# EAGLE design Linkable_LED_Matrix (EAGLE 7.1.0)
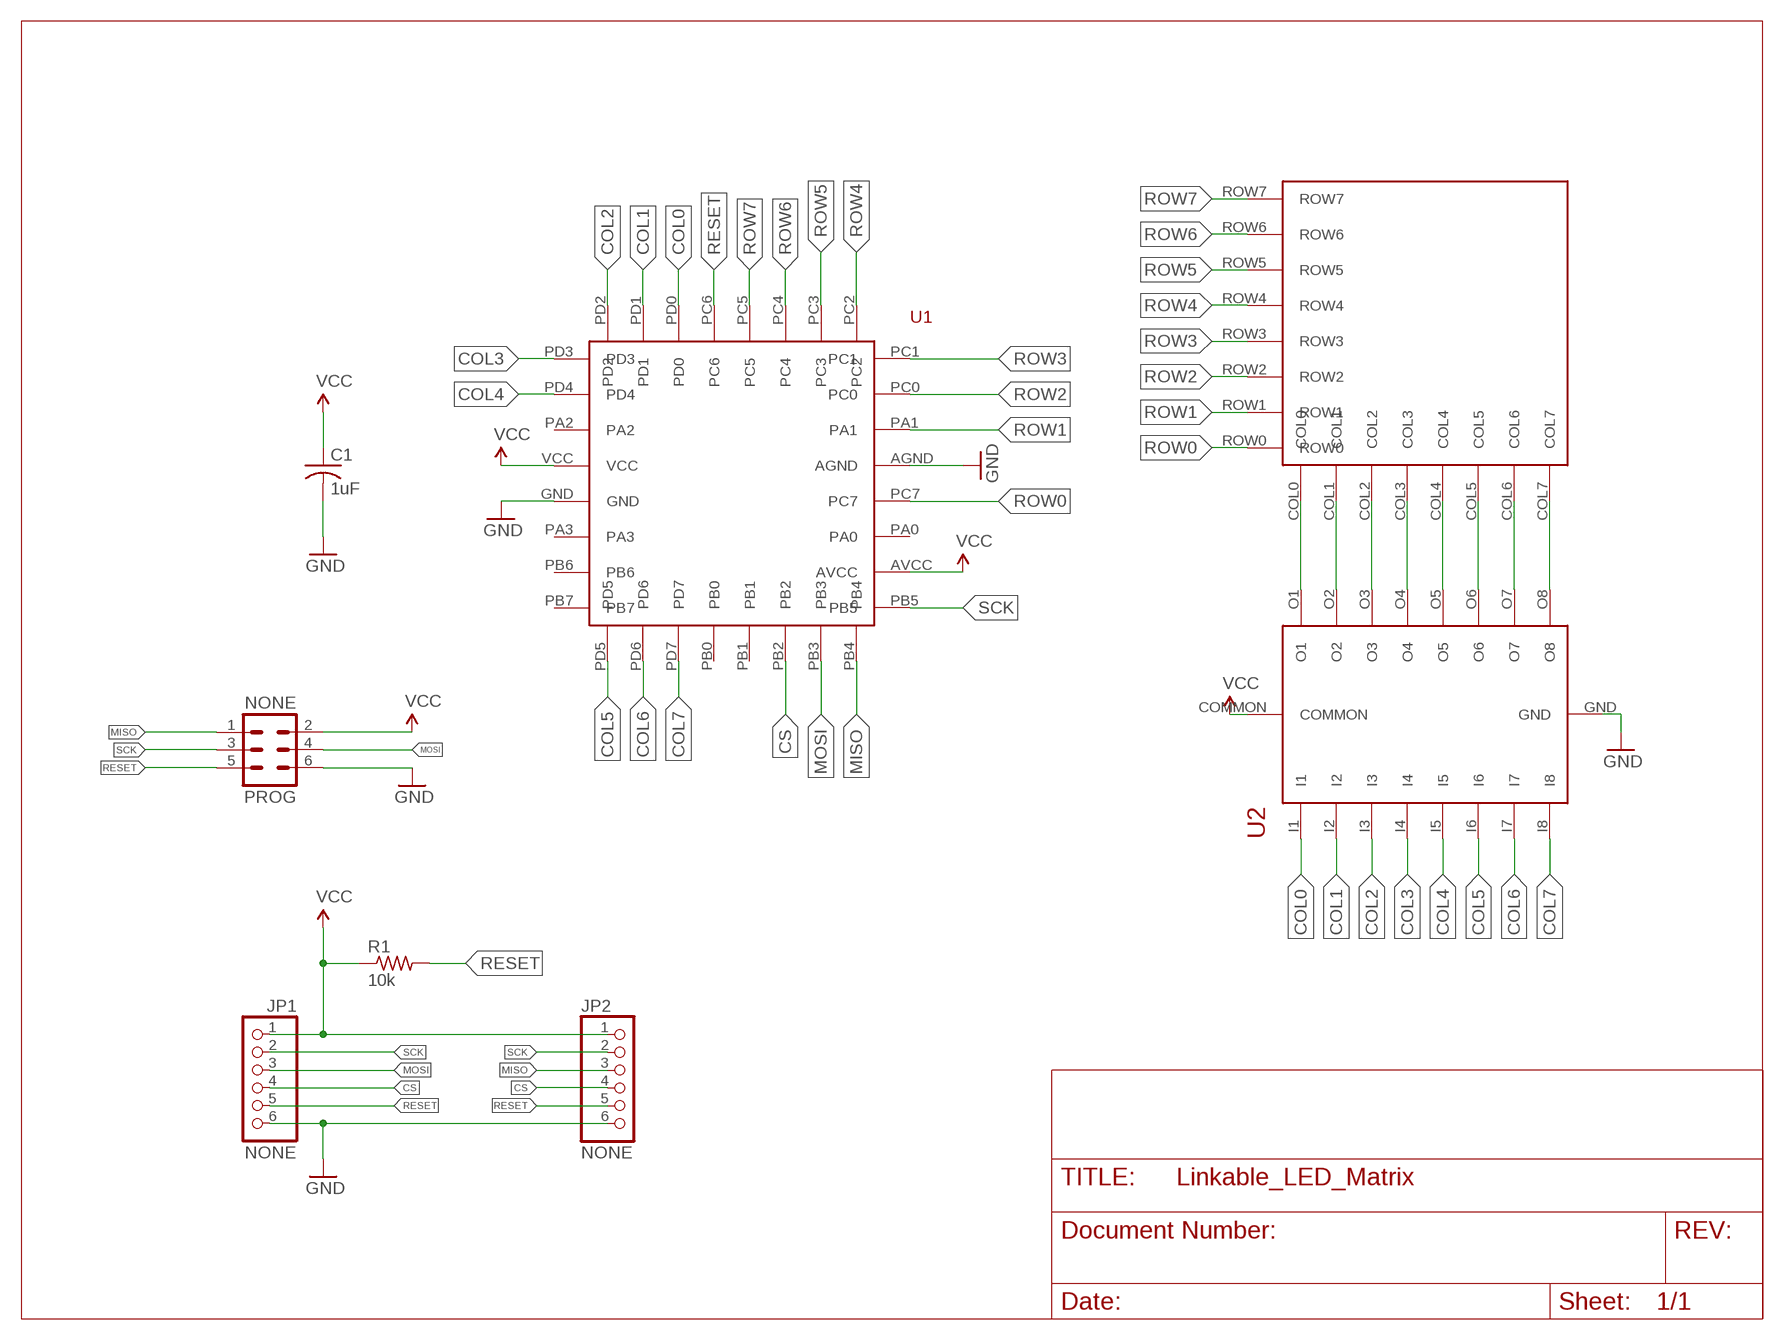
[diagram p0: schematic, sheet 1]

## Parts
C1  1uF  C-USC0603  [C0603]
JP1  NONE  PINHD-1X6  [1X06]
JP2  NONE  PINHD-1X6  [1X06]
LEDMATRIX  8X8_LED_MATRIX  [8X8_LED_MATRIX]
PROG  NONE  MA03-2  [MA03-2]
R1  10k  R-US_R0603  [R0603]
U1  ATTINY48  [ATTINY48]
U2  ULN2803AFWG  [ULN2803AFWG]

## Nets
COL0: U1.PD0 U2.I1
COL1: U1.PD1 U2.I2
COL2: U1.PD2 U2.I3
COL3: U1.PD3 U2.I4
COL4: U1.PD4 U2.I5
COL5: U1.PD5 U2.I6
COL6: U1.PD6 U2.I7
COL7: U1.PD7 U2.I8
CS: JP1.4 JP2.4 U1.PB2
GND: C1.2 JP1.6 JP2.6 PROG.6 U1.AGND U1.GND U2.GND
MISO: JP2.3 PROG.1 U1.PB4
MOSI: JP1.3 PROG.4 U1.PB3
N$1: LEDMATRIX.COL0 U2.O1
N$2: LEDMATRIX.COL1 U2.O2
N$3: LEDMATRIX.COL2 U2.O3
N$4: LEDMATRIX.COL3 U2.O4
N$5: LEDMATRIX.COL4 U2.O5
N$6: LEDMATRIX.COL5 U2.O6
N$7: LEDMATRIX.COL6 U2.O7
N$8: LEDMATRIX.COL7 U2.O8
RESET: JP1.5 JP2.5 PROG.5 R1.2 U1.PC6
ROW0: LEDMATRIX.ROW0 U1.PC7
ROW1: LEDMATRIX.ROW1 U1.PA1
ROW2: LEDMATRIX.ROW2 U1.PC0
ROW3: LEDMATRIX.ROW3 U1.PC1
ROW4: LEDMATRIX.ROW4 U1.PC2
ROW5: LEDMATRIX.ROW5 U1.PC3
ROW6: LEDMATRIX.ROW6 U1.PC4
ROW7: LEDMATRIX.ROW7 U1.PC5
SCK: JP1.2 JP2.2 PROG.3 U1.PB5
VCC: C1.1 JP1.1 JP2.1 PROG.2 R1.1 U1.AVCC U1.VCC U2.COMMON
Unconnected: U1.PA0 U1.PA2 U1.PA3 U1.PB0 U1.PB1 U1.PB6 U1.PB7

## Library data of the parts
C1 = resistor:C-US: CAPACITOR, American symbol
JP1 JP2 = raspberrystem:PINHD-1X6: PIN HEADER
LEDMATRIX = raspberrystem:8X8_LED_MATRIX
PROG = raspberrystem:MA03-2: PIN HEADER; OC_FARNELL: unknown; OC_NEWARK: unknown
R1 = resistor:R-US_: RESISTOR, American symbol
U1 = raspberrystem:ATTINY48
U2 = raspberrystem:ULN2803AFWG

## Net classes
1 power: width 0.305 mm

## Board
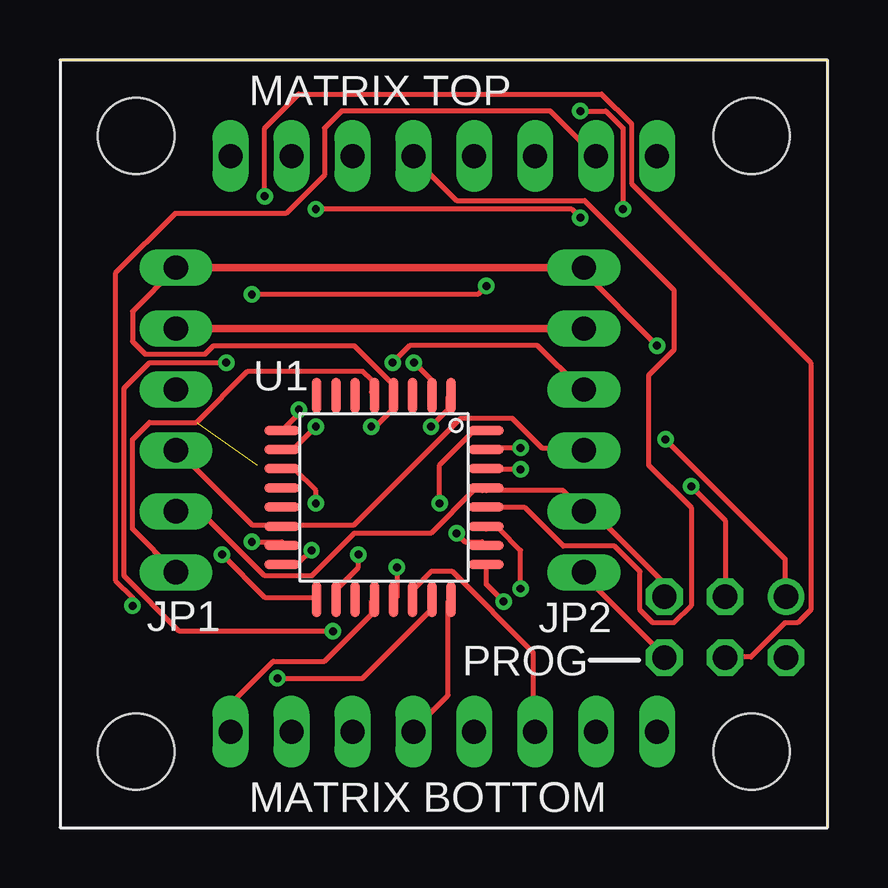
[diagram p1: board, top side]
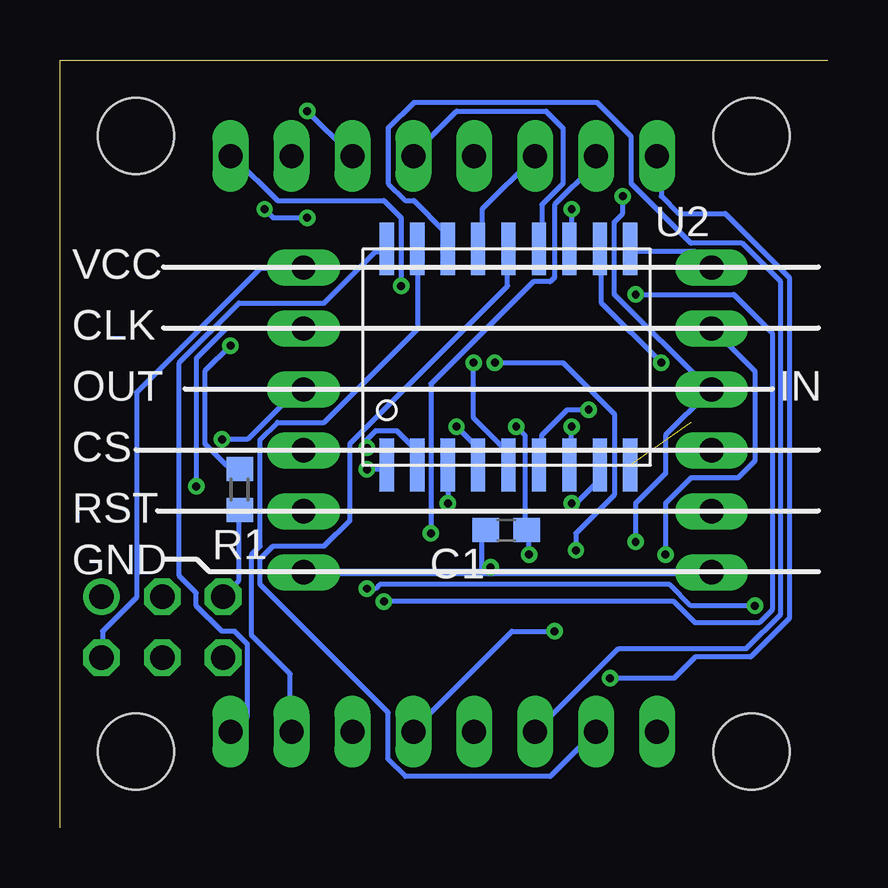
[diagram p2: board, bottom side, seen from below]

Size 32 x 32 mm. Coordinates in mm from the lower left corner, seen from the top.
Outline: 32,0 32,32 0,32
Copper layers (1*16): Top 0.0356mm / dielectric 1.5011mm / Bottom 0.0356mm
Design rules "LaenPCBOrder *": minimum track width 8mil, minimum drill 13mil, track to track 6mil, track to pad 6mil, pad to pad 6mil, via to via 6mil, smd to smd 6mil, copper to edge 15mil, drill to drill 6mil, minimum pad ring 7mil, minimum via ring 7mil, stop-mask expansion 3mil, vias tented up to drill 0mil, thermal gap 10mil
Holes 3.17 mm at 3.17,3.17 3.17,28.83 28.83,28.83 28.83,3.17
tRestrict: area 0,0 to 6.2,6.2; area 0,25.8 to 6.2,32; area 25.8,25.8 to 32,32; area 25.8,0 to 32,6.2
bRestrict: area 0,0 to 6.2,6.2; area 25.8,25.8 to 32,32; area 0,25.8 to 6.2,32; area 25.8,0 to 32,6.2
vRestrict: area 0,0 to 6.2,6.2; area 0,25.8 to 6.2,32; area 25.8,25.8 to 32,32; area 25.8,0 to 32,6.2; area 28.2,10.2 to 31.9,24.3; area 0,17.4 to 2.4,19.4

### Footprints (pad centres in the part's own frame; a part is rotated, then mirrored left to right if it is on the bottom)
C0603 = smd 1.1 x 1: 1 -0.85,0; 2 0.85,0
1X06 = drill 1.016 long: 1 -6.35,0; 2 -3.81,0; 3 -1.27,0; 4 1.27,0; 5 3.81,0; 6 6.35,0
8X8_LED_MATRIX = drill 1 long: COL0 8.89,-12; COL1 6.35,-12; COL2 -3.81,-12; COL3 -3.81,12; COL4 -6.35,-12; COL5 1.27,12; COL6 3.81,12; COL7 1.27,-12; ROW0 -8.89,-12; ROW1 3.81,-12; ROW2 -8.89,12; ROW3 -1.27,-12; ROW4 8.89,12; ROW5 -6.35,12; ROW6 6.35,12; ROW7 -1.27,12
MA03-2 = drill 1.016: 1 -2.54,-1.27 | drill 1.016 octagon: 2 -2.54,1.27; 3 0,-1.27; 4 0,1.27; 5 2.54,-1.27; 6 2.54,1.27
R0603 = smd 1 x 1.1: 1 -0.85,0; 2 0.85,0
ATTINY48 = smd 1.5 x 0.406: AGND 4.25,0.4; AVCC 4.25,-2; GND -4.25,-0.4; PA0 4.25,-1.2; PA1 4.25,1.2; PA2 -4.25,1.2; PA3 -4.25,-1.2; PB5 4.25,-2.8; PB6 -4.25,-2; PB7 -4.25,-2.8; PC0 4.25,2; PC1 4.25,2.8; PC7 4.25,-0.4; PD3 -4.25,2.8; PD4 -4.25,2; VCC -4.25,0.4 | smd 0.406 x 1.5: PB0 -0.4,-4.25; PB1 0.4,-4.25; PB2 1.2,-4.25; PB3 2,-4.25; PB4 2.8,-4.25; PC2 2.8,4.25; PC3 2,4.25; PC4 1.2,4.25; PC5 0.4,4.25; PC6 -0.4,4.25; PD0 -1.2,4.25; PD1 -2,4.25; PD2 -2.8,4.25; PD5 -2.8,-4.25; PD6 -2,-4.25; PD7 -1.2,-4.25
ULN2803AFWG = smd 0.6 x 2.2: COMMON 10.16,9.01; GND 10.16,0; I1 0,0; I2 1.27,0; I3 2.54,0; I4 3.81,0; I5 5.08,0; I6 6.35,0; I7 7.62,0; I8 8.89,0; O1 0,9.01; O2 1.27,9.01; O3 2.54,9.01; O4 3.81,9.01; O5 5.08,9.01; O6 6.35,9.01; O7 7.62,9.01; O8 8.89,9.01

### Placement (x,y rotation side)
C1  13.4,12.4 180 bottom
JP1  4.83,16.99 270 top
JP2  21.84,16.99 270 top
LEDMATRIX  16,16 0 top
PROG  27.74,8.36 180 top
R1  24.5,14.1 270 bottom
U1  13.51,13.76 270 top
U2  18.38,15.11 0 bottom

### Tracks (layer width: path | path; a pad name or v marks a point on that pad's centre or on a via)
COL0  (via drill 0.33)
  Top 0.203: v19.2,14.94 17.78,14.94 U1.PD0
  Bottom 0.203: v19.2,14.94 18.49,14.94 U2.I1
COL1  (via drill 0.33)
  Top 0.203: v19.2,15.82 17.78,15.82 U1.PD1
  Bottom 0.203: v19.2,15.82 19.2,16.18 18.85,16.54 17.96,16.54 17.25,15.82 17.25,15.11 U2.I2
COL2  (via drill 0.33)
  Top 0.203: v15.82,13.51 15.82,15.11 17.25,16.54 17.6,16.54 U1.PD2
  Bottom 0.203: v15.82,13.51 15.82,14.94 U2.I3
COL3  (via drill 0.33)
  Top 0.203: v15.47,16.71 16.18,17.42 16.18,17.96 U1.PD3
  Bottom 0.203: v15.47,16.71 14.58,15.82 U2.I4
COL4  (via drill 0.33)
  Top 0.203: v14.76,19.38 15.47,18.67 15.47,18.14 U1.PD4
  Bottom 0.203: v14.76,19.38 14.76,17.07 13.34,15.65 13.34,15.11 U2.I5
COL5  (via drill 0.33)
  Top 0.203: v9.96,17.42 9.96,17.25 9.42,16.71 U1.PD5
  Bottom 0.203: v9.96,17.42 10.85,17.42 11.91,16.36 11.91,15.11 U2.I6
COL6  (via drill 0.33)
  Top 0.203: v10.67,16.71 9.78,15.82 9.42,15.82 U1.PD6
  Bottom 0.203: v10.67,16.71 10.67,15.11 U2.I7
COL7  (via drill 0.33)
  Top 0.203: v10.67,13.51 10.67,14.05 9.78,14.94 9.42,14.94 U1.PD7
  Bottom 0.203: v10.67,13.51 10.49,13.51 9.6,14.4 9.6,14.94 U2.I8
CS
  Top 0.203: JP1.4 4.98,15.65 8,12.62 9.25,12.62 U1.PB2 9.42,12.62 12.27,12.62 16.71,17.07 18.85,17.07 20.09,15.82 21.69,15.82 JP2.4
GND  (via drill 0.33)  (1 unrouted)
  Top 0.203: JP2.6 21.87,10.49 25.25,7.11 PROG.6 | v14.05,10.85 14.05,9.6 U1.AGND | JP1.6 3.02,12.45 3.02,16.18 3.73,16.89 5.69,16.89 7.82,19.02 12.62,19.02 12.98,18.67 12.98,18.14 U1.GND
  Bottom 0.203: 14.4,10.64 14.4,12.27 C1.2 | 14.05,10.64 v14.05,10.85
  Bottom 0.305: JP1.6 14.05,10.64 14.4,10.64 JP2.6
MISO  (via drill 0.33)
  Top 0.203: v10.49,11.56 9.96,11.02 9.42,11.02 U1.PB4 | v13.87,19.38 14.58,20.09 19.91,20.09 21.69,18.31 JP2.3 | v25.25,16.18 30.23,11.2 30.23,9.78 PROG.1
  Bottom 0.203: v10.49,11.56 10.49,12.27 8.89,13.87 8.89,17.25 11.02,19.38 v13.87,19.38 | v25.25,16.18 24.18,16.18 22.23,18.14 21.87,18.14 JP2.3
MOSI  (via drill 0.33)
  Top 0.203: v8,11.91 9.25,11.91 U1.PB3 | v8.53,26.31 8.53,29.16 9.96,30.58 22.58,30.58 23.82,29.34 23.82,26.85 31.29,19.38 31.29,9.07 30.76,8.53 30.23,8.53 28.8,7.11 27.74,7.11 PROG.4
  Bottom 0.203: v8,11.91 8,13.51 6.76,14.76 6.76,16.36 4.98,18.14 JP1.3 4.98,18.31 8.89,22.23 8.89,25.25 8.53,25.6 v8.53,26.31
N$1
  Bottom 0.203: U2.O1 18.49,24 18.85,24 20.98,21.87 24.54,21.87 27.03,19.38 27.03,10.49 26.31,9.78 26.31,9.25 25.25,8.18 24.71,8.18 24.18,7.64 24.18,4.62 24.71,4.09 LEDMATRIX.COL0
N$2
  Bottom 0.203: U2.O2 17.07,24 17.07,20.8 20.98,16.89 22.94,16.89 23.65,16.18 23.65,11.73 24,11.38 24,8 22.4,6.4 22.4,4.09 LEDMATRIX.COL1
N$3
  Bottom 0.203: U2.O3 16,24.18 16,24.89 17.25,26.14 17.6,26.14 18.31,26.85 18.31,29.16 17.25,30.23 9.6,30.23 8.18,28.8 8.18,26.85 5.69,24.36 3.56,24.36 1.96,22.76 1.96,8.89 3.38,7.47 8.71,7.47 12.09,4.09 LEDMATRIX.COL2
N$4
  Bottom 0.203: U2.O4 14.4,24.18 14.4,25.78 12.27,27.91 LEDMATRIX.COL3
N$5
  Bottom 0.203: U2.O5 13.34,24 13.34,22.58 19.91,16 19.91,12.8 20.98,11.73 23.11,11.73 23.65,11.2 23.65,10.13 18.31,4.8 18.31,2.85 17.6,2.13 11.56,2.13 9.78,3.91 LEDMATRIX.COL4
N$6
  Bottom 0.203: U2.O6 11.91,24.18 11.91,25.96 11.02,26.85 11.02,29.16 11.73,29.87 15.47,29.87 17.25,28.09 LEDMATRIX.COL5
N$7  (via drill 0.33)
  Top 0.203: v10.67,25.78 21.34,25.78 v21.69,25.43 | v23.47,25.78 23.47,29.16 22.76,29.87 v21.69,29.87
  Bottom 0.203: v10.67,25.78 10.67,24.18 U2.O7 | v21.69,25.43 23.11,25.43 v23.47,25.78 | v21.69,29.87 19.91,28.09 LEDMATRIX.COL6
N$8  (via drill 0.33)
  Top 0.203: v6.93,19.38 3.73,19.38 2.67,18.31 2.67,10.49 4.98,8.18 v11.38,8.18
  Bottom 0.203: v6.93,19.38 9.42,21.87 9.42,24 U2.O8 | v11.38,8.18 13.16,8.18 17.25,4.09 LEDMATRIX.COL7
RESET
  Top 0.203: JP1.5 4.98,13.16 5.87,13.16 8.53,10.49 10.49,10.49 12.27,12.27 15.47,12.27 17.25,14.05 17.6,14.05 U1.PC6 17.78,14.05 20.98,14.05 JP2.5 21.87,13.16 22.23,13.16 25.07,10.31 25.07,9.78 PROG.5
  Bottom 0.203: R1.2 24.54,13.16 24.54,10.31 25.07,9.78 PROG.5
ROW0
  Top 0.203: U1.PC7 12.98,9.42 12.98,8.89 11.02,6.93 8.89,6.93 7.11,5.16 7.11,4.09 LEDMATRIX.ROW0
ROW1
  Top 0.203: U1.PA1 14.76,9.6 14.76,9.96 15.47,10.67 16.36,10.67 19.74,7.29 19.74,4.09 LEDMATRIX.ROW1
ROW2  (via drill 0.33)
  Top 0.203: v9.07,6.22 12.62,6.22 15.47,9.07 15.47,9.42 U1.PC0
  Bottom 0.203: v9.07,6.22 6.4,6.22 5.51,7.11 3.2,7.11 1.6,8.71 1.6,22.94 4.27,25.6 6.22,25.6 6.93,26.31 6.93,27.91 LEDMATRIX.ROW2
ROW3
  Top 0.203: U1.PC1 16.18,9.42 16.18,5.51 14.76,4.09 LEDMATRIX.ROW3
ROW4  (via drill 0.33)
  Top 0.203: v18.49,9.42 17.78,10.13 17.78,10.85 U1.PC2 | v8,22.23 17.42,22.23 v17.78,22.58
  Bottom 0.203: v18.49,9.42 6.4,9.42 5.51,8.53 2.85,8.53 2.31,9.07 2.31,20.62 3.91,22.23 v8,22.23 | v17.78,22.58 17.78,25.43 18.49,26.14 22.94,26.14 24.71,27.91 LEDMATRIX.ROW4
ROW5  (via drill 0.33)
  Top 0.203: v16.54,12.27 16.89,11.91 17.6,11.91 U1.PC3
  Bottom 0.203: v16.54,12.27 16.54,18.49 12.27,22.76 11.56,22.76 11.38,22.94 11.38,25.96 9.78,27.56 9.78,27.91 LEDMATRIX.ROW5
ROW6  (via drill 0.33)
  Top 0.203: v19.2,9.96 19.2,11.56 18.31,12.45 17.78,12.45 U1.PC4 | v3.02,9.25 3.02,9.6 2.31,10.31 2.31,23.11 4.8,25.6 9.42,25.6 11.02,27.2 11.02,29.16 11.73,29.87 20.45,29.87 22.23,28.09 LEDMATRIX.ROW6
  Bottom 0.203: v19.2,9.96 18.85,9.96 18.67,10.13 6.58,10.13 5.69,9.25 v3.02,9.25
ROW7
  Top 0.203: U1.PC5 17.78,13.34 19.38,13.34 20.98,11.73 23.11,11.73 24.18,10.67 24.18,9.07 24.71,8.53 25.6,8.53 26.31,9.25 26.31,13.34 24.54,15.11 24.54,18.85 25.6,19.91 25.6,22.4 21.87,26.14 16.54,26.14 14.76,27.91 LEDMATRIX.ROW7
SCK  (via drill 0.33)
  Top 0.203: v6.76,11.38 8.53,9.6 10.67,9.6 U1.PB5 | PROG.3 27.74,12.8 v26.31,14.22
  Top 0.305: JP1.2 JP2.2
  Bottom 0.203: v6.76,11.38 6.76,13.51 5.69,14.58 3.73,14.58 3.02,15.29 3.02,19.02 4.8,20.8 JP1.2 | v26.31,14.22 26.31,19.56 25.07,20.8 JP2.2
VCC  (via drill 0.33)
  Top 0.203: v12.45,11.38 12.45,10.85 11.56,9.96 11.56,9.6 U1.AVCC | v24.89,20.09 21.69,23.29 JP2.1 | JP1.1 4.8,23.29 3.02,21.51 3.02,20.27 3.56,19.74 6.04,19.74 6.4,20.09 12.27,20.09 13.87,18.49 13.87,18.14 U1.VCC 13.87,17.96 13.87,17.42 13.16,16.71 v12.98,16.71
  Top 0.305: JP1.1 JP2.1
  Bottom 0.203: v12.45,11.38 12.45,12.27 C1.1 12.62,12.45 12.62,16.36 v12.98,16.71 | v24.89,20.09 25.96,19.02 25.96,16 25.07,15.11 24.54,15.11 R1.1 | U2.COMMON 8.18,24 5.51,24 4.98,23.47 JP1.1 | PROG.2 30.23,7.11 30.23,8.18 28.8,9.6 28.8,18.14 23.65,23.29 21.87,23.29 JP2.1

### Text on the board
tPlace: MATRIX TOP | MATRIX BOTTOM
bPlace: VCC | CLK | IN | OUT | CS | RST | GND